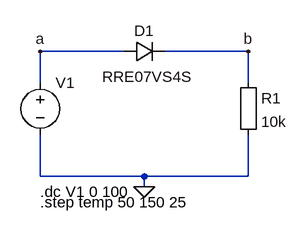
[diagram p0: schematic diode-va-forward-100.asc]
diode-va-forward-100.asc, the LTspice schematic file:
Version 4
SHEET 1 880 680
WIRE 16 160 -112 160
WIRE 208 160 80 160
WIRE -112 208 -112 160
WIRE 208 208 208 160
WIRE -112 352 -112 288
WIRE 48 352 -112 352
WIRE 208 352 208 288
WIRE 208 352 48 352
WIRE 48 368 48 352
FLAG -112 160 a
FLAG 208 160 b
FLAG 48 368 0
SYMBOL diode 16 176 R270
WINDOW 0 32 32 VTop 2
WINDOW 3 -7 36 VBottom 2
SYMATTR InstName D1
SYMATTR Value RRE07VS4S
SYMBOL Misc\\EuropeanResistor 192 192 R0
SYMATTR InstName R1
SYMATTR Value 10k
SYMBOL voltage -112 192 R0
SYMATTR InstName V1
SYMATTR Value ""
TEXT -112 376 Left 2 !.dc V1 0 100
TEXT -112 392 Left 2 !.step temp 50 150 25

The netlist it stands for:
* diode-va-forward-100.asc
D1 a b RRE07VS4S
R1 b 0 10k
V1 a 0
.model D D
.lib standard.dio
.dc V1 0 100
.step temp 50 150 25
.backanno
.end